# Altium schematic sheet interface-switches.SchDoc
size A4; SheetNumber: 9; SheetTotal: 9
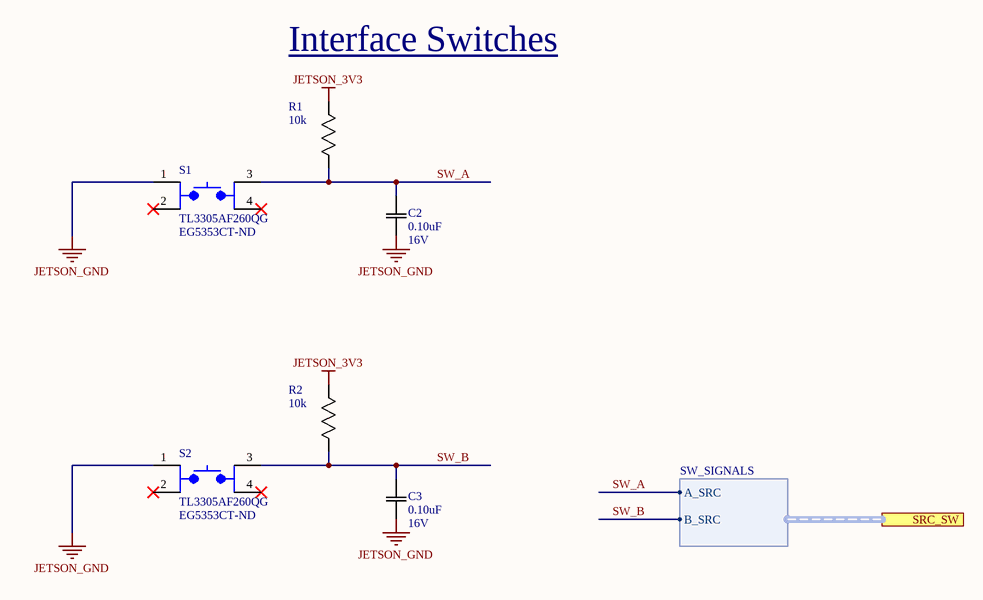
[diagram p0: interface-switches.SchDoc]

## Parts
C2  Rating: 16V  [0603]  (hidden comment: 0.10uF)
C3  Rating: 16V  [0603]  (hidden comment: 0.10uF)
R1  10k  [0603]
R2  10k  [0603]
S1  TL3305AF260QG  Supplier Part Number 1: EG5353CT-ND  [SW_TL3305AF260QG]
S2  TL3305AF260QG  Supplier Part Number 1: EG5353CT-ND  [SW_TL3305AF260QG]

## Ports
SRC_SW (harness SW_SIGNALS)

## Harnesses
SW_SIGNALS: A_SRC, B_SRC

## Nets
JETSON_3V3: R1.1(R1) R2.1(R1)
JETSON_GND: C2.1(C1) C3.1(C1) S1.1 S2.1
SW_A: C2.2(C2) R1.2(R2) S1.3 ; port SRC_SW.A_SRC
SW_B: C3.2(C2) R2.2(R2) S2.3 ; port SRC_SW.B_SRC

Not connected (* = marked no-connect by the designer): S1 2* 4*; S2 2* 4*

## Notes on the sheet
- (near R1) Interface Switches

## Library data of the parts
C2 C3 = CAP 0.10uF 16V: CAP CER 0.10UF 16V X5R 0603; Tolerance: 10%; Package: 0603/0805; Temperature Coefficient: X5R; Operating Temperature: -55°C ~ 85°C; Value: 0.10uF; Part Number: CAP 0.10uF 16V
R1 R2 = RES 10k 1/8W - 5%: RES SMD 10K OHM 5% 1/8W 0805; Power (Watts): 0.125W; Package: 0805; Value: 10k; Tolerance: 5%; Part Number: RES 10k 1/8W - 5%
S1 S2 = SW PUSH SMD: Tactile Switch SPST-NO Top Actuated Surface Mount; MF: E-Switch; Price: None; Value: *; MP: TL3305AF260QG; Package: LQFP-48 E-Switch; SnapEDA_Link: https://www.snapeda.com/parts/TL3305AF260QG/E-Switch/view-part/479903/?ref=snap; Availability: Unavailable; Supplier 1: Digi-key; Part Number: SW PUSH SMD; Manufacturer Part Number 1: TL3305AF260QG; Supplier URL 1: https://www.digikey.com/en/products/detail/e-switch/TL3305AF260QG/5816184